# Altium schematic sheet MUX 2x(4x1) 74HCT4052D.SchDoc
size 124 x 90 mm
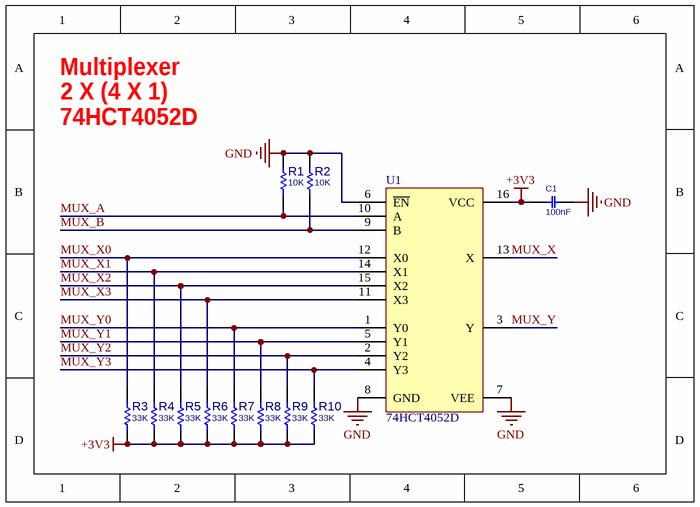
[diagram p0: MUX 2x(4x1) 74HCT4052D.SchDoc]

## Parts
C1  100nF  [C0603S]
R1  10K  [R0603S]
R2  10K  [R0603S]
R3  33K  [R0603S]
R4  33K  [R0603S]
R5  33K  [R0603S]
R6  33K  [R0603S]
R7  33K  [R0603S]
R8  33K  [R0603S]
R9  33K  [R0603S]
R10  33K  [R0603S]
U1  74HCT4052D  [SO_16]

## Nets
+3V3: C1.2 R3.1 R4.1 R5.1 R6.1 R7.1 R8.1 R9.1 R10.1 U1.16(VCC)
GND: C1.1 R1.2 R2.2 U1.6(~{EN}) U1.7(VEE) U1.8(GND)
MUX_A: R1.1 U1.10(A)
MUX_B: R2.1 U1.9(B)
MUX_X: U1.13(X)
MUX_X0: R3.2 U1.12(X0)
MUX_X1: R4.2 U1.14(X1)
MUX_X2: R5.2 U1.15(X2)
MUX_X3: R6.2 U1.11(X3)
MUX_Y: U1.3(Y)
MUX_Y0: R7.2 U1.1(Y0)
MUX_Y1: R8.2 U1.5(Y1)
MUX_Y2: R9.2 U1.2(Y2)
MUX_Y3: R10.2 U1.4(Y3)

## Notes on the sheet
- Multiplexer
- 2 X (4 X 1)
- 74HCT4052D

## Library data of the parts
C1 = CAP_SMD_MLCC: CAP, SMD, MLCC; PARAM: 50V; DESC: CAP, MLCC, 1nF, 50V, C0G, 10%, 0402; MANF_P#: MANF_PART#; MANF: Murata; PARAM2: C0G, 10%; PRICE: 100= 1$; ASSEMBLY: ASSEMBLY; VALUE: 100nF
R1-R10 = RES_SMD: RES, SMD; MANF_P#: RK73H1ETTP4701F; MANF: KOA SPEER; PARAM: 0.063W; DESC: DESCRIPTION; DIST#: MOUSER; PARAM2: 1%; ASSEMBLY: ASSEMBLY; PRICE: 100= 0.5$
  R1 R2: VALUE: 10K
  R3-R10: VALUE: 33K
U1 = MC74HC4052D: Dual 4-Channel Analog Multiplexer/Demultiplexer; Package Information: Latest Revision: Oct-1999; Code - JEDEC: MS-012-AC; Code - IPC: SO16; Published: 15-Apr-2002; Datasheet: Latest Revision: 1995; Package Reference: 751B-05; Publisher: Altium Limited